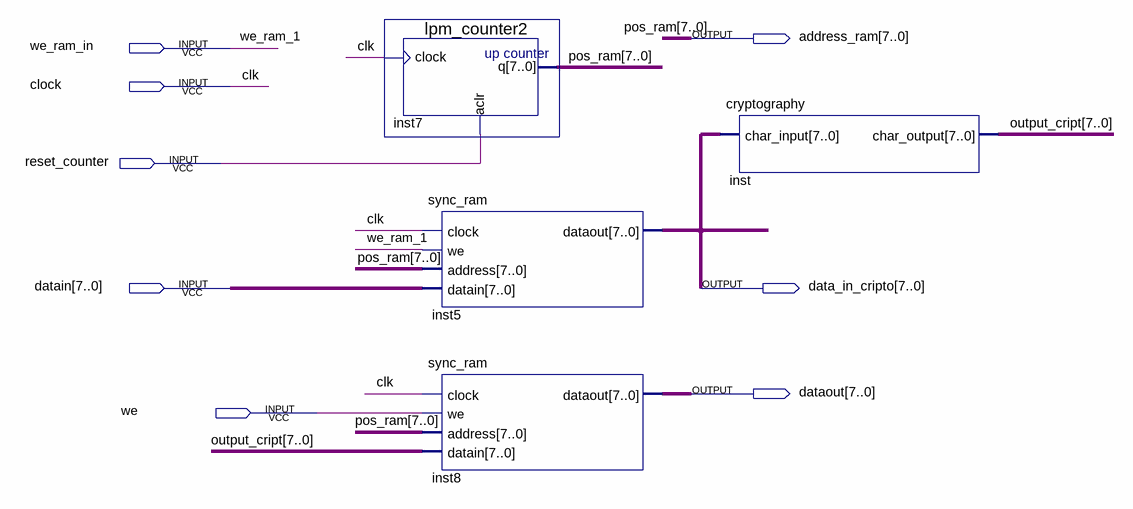
[diagram p0: schematic sheet]
// Quartus schematic projeto_final_logica.bdf as structural Verilog: 4 symbols, 8 pins
module projeto_final_logica (
  input  we_ram_in,
  input  clock,
  input  reset_counter,
  input  [7:0] datain,
  input  we,
  output [7:0] address_ram,
  output [7:0] data_in_cripto,
  output [7:0] dataout
);

  wire [7:0] output_cript;

  lpm_counter2 inst7 (.clock(clock), .aclr(reset_counter), .q(address_ram));
  sync_ram inst5 (.clock(clock), .we(we_ram_in), .address(address_ram), .datain(datain), .dataout(data_in_cripto));
  sync_ram inst8 (.clock(clock), .we(we), .address(address_ram), .datain(output_cript), .dataout(dataout));
  cryptography inst (.char_input(data_in_cripto), .char_output(output_cript));

  // Other names for the same wires on the sheet: clk = clock; pos_ram[7:0] = address_ram; we_ram_1 = we_ram_in
endmodule
